# EAGLE design StasDuino_Rev3 (EAGLE 9.5.2)
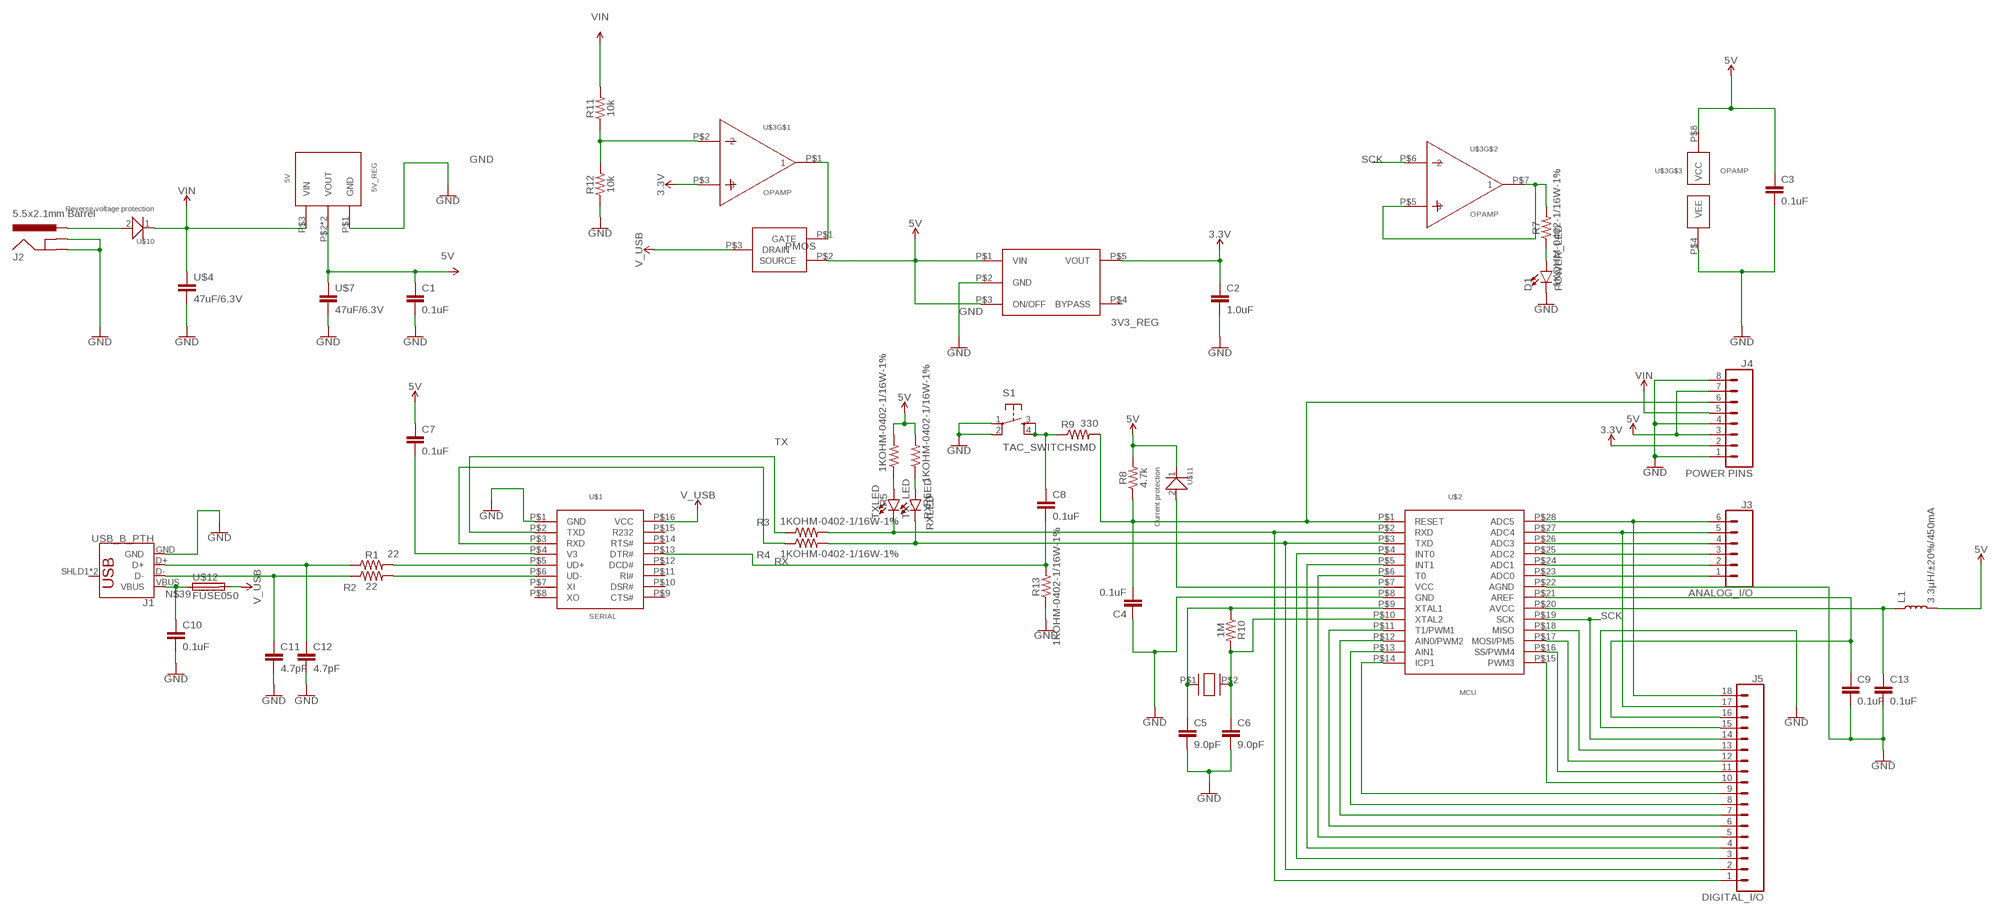
[diagram p0: schematic, sheet 1]

## Parts
3V3_REG  3V3  3V3_REGULATOR  [3V3-REGULATOR]
5V_REG  5V  5V_REGULATOR  [5V_REGULATOR]
C1  0.1uF  0.1UF-0402-16V-10%  [0402]
C2  1.0uF  1.0UF-0402-16V-10%  [0402]
C3  0.1uF  0.1UF-0402-16V-10%  [0402]
C4  0.1uF  0.1UF-0402-16V-10%  [0402]
C5  9.0pF  9.0PF-0603-50V-10%  [0603]
C6  9.0pF  9.0PF-0603-50V-10%  [0603]
C7  0.1uF  0.1UF-0402-16V-10%  [0402]
C8  0.1uF  0.1UF-0402-16V-10%  [0402]
C9  0.1uF  0.1UF-0402-16V-10%  [0402]
C10  0.1uF  0.1UF-0402-16V-10%  [0402]
C11  4.7pF  4.7PF-0603-50V-5%  [0603]
C12  4.7pF  4.7PF-0603-50V-5%  [0603]
C13  0.1uF  0.1UF-0402-16V-10%  [0402]
D1  POWER_LED  LED0603  [LED-0603]
J1  USB_B_PTH  [USB-B-PTH]
J2  5.5x2.1mm Barrel  POWER_JACKSMD  [POWER_JACK_SMD]
J3  ANALOG_I/O  CONN_06NO_SILK_FEMALE_PTH  [1X06_NO_SILK]
J4  POWER PINS  CONN_08NO_SILK_FEMALE_PTH  [1X08_NO_SILK]
J5  DIGITAL_I/O  CONN_18  [1X18_NO_SILK]
L1  3.3µH/±20%/450mA  INDUCTOR-0805-3.3UH  [0805]
PMOS  PMOS  [PMOSFET]
R1  22  22OHM-0402-1/10W-1%  [0402]
R2  22  22OHM-0402-1/10W-1%  [0402]
R3  1KOHM-0402-1/16W-1%  [0402]
R4  1KOHM-0402-1/16W-1%  [0402]
R5  1KOHM-0402-1/16W-1%  [0402]
R6  1KOHM-0402-1/16W-1%  [0402]
R7  1KOHM-0402-1/16W-1%  [0402]
R8  4.7k  4.7KOHM-0603-1/10W-1%  [0603]
R9  330  330OHM-0603-1/10W-1%  [0603]
R10  1M  1MOHM-0603-1/4W-5%  [0603]
R11  10k  10KOHM-0402-1/16W-1%  [0402]
R12  10k  10KOHM-0402-1/16W-1%  [0402]
R13  1KOHM-0402-1/16W-1%  [0402]
RXLED  RX_LED  LED0603  [LED-0603]
S1  TAC_SWITCHSMD  [TACTILE-SWITCH-SMD]
TXLED  TX_LED  LED0603  [LED-0603]
U$1  SERIAL  CH340C  [CH340G/C]
U$2  MCU  ATMEGA328P  [ATMEGA328P]
U$3  OPAMP  DUAL_OPAMP  [DUAL_OPAMP]
U$4  47uF/6.3V  47UF  [0805]
U$7  47uF/6.3V  47UF  [0805]
U$8  16MHz  CRYSTAL  [CRYSTAL]
U$10  Reverse voltage protection  DIODE_GEN_PURPDIODE  [0402]
U$11  Current protection  DIODE_GEN_PURPDIODE  [0402]
U$12  FUSE050  [MF-SMDF050]

## Nets
3.3V: 3V3_REG.P$5(VOUT) C2.1 J4.2 U$3.P$3
5V: 3V3_REG.P$1(VIN) 3V3_REG.P$3(ON/OFF) 5V_REG.P$2(VOUT) 5V_REG.P$2B(VOUT) C1.1 C3.1 C7.1 J4.3 J4.7 L1.2 PMOS.P$2(SOURCE) R5.2 R6.2 R8.2 U$3.P$8(VCC) U$7.1 U$11.1
D+: R1.2 U$1.P$5(UD+)
GND: 3V3_REG.P$2(GND) 5V_REG.P$1(GND) C1.2 C2.2 C3.2 C4.1 C5.2 C6.2 C9.2 C10.2 C11.2 C12.2 C13.2 D1.C J1.GND J2.GND(GNDBREAK) J2.P$4(GND) J4.1 J4.4 J4.8 J5.15 R12.1 R13.1 S1.1 S1.2 U$1.P$1(GND) U$2.P$8(GND) U$2.P$22(AGND) U$3.P$4(VEE) U$4.2 U$7.2
N$1: C12.1 J1.D+ R1.1
N$2: C4.2 J4.6 R8.1 R9.2 U$2.P$1(RESET)
N$3: C11.1 J1.D- R2.1
N$4: R2.2 U$1.P$6(UD-)
N$5: J5.2 R4.2 RXLED.C U$2.P$3(TXD)
N$6: J5.1 R3.2 TXLED.C U$2.P$2(RXD)
N$7: C8.1 R9.1 S1.3 S1.4
N$8: R5.1 TXLED.A
N$9: R6.1 RXLED.A
N$10: D1.A R7.1
N$11: R7.2 U$3.P$5 U$3.P$7
N$12: C5.1 R10.1 U$2.P$9(XTAL1) U$8.P$1
N$13: C6.1 R10.2 U$2.P$10(XTAL2) U$8.P$2
N$14: J3.6 J5.18 U$2.P$28(ADC5)
N$15: PMOS.P$1(GATE) U$3.P$1
N$16: J2.VIN0(PWR) U$10.2
N$17: R11.1 R12.2 U$3.P$2
N$18: C7.2 U$1.P$4(V3)
N$19: C8.2 R13.2 U$1.P$13(DTR#)
N$20: U$2.P$7(VCC) U$11.2
N$21: J3.5 J5.17 U$2.P$27(ADC4)
N$22: J3.4 U$2.P$26(ADC3)
N$23: J3.3 U$2.P$25(ADC2)
N$24: J3.2 U$2.P$24(ADC1)
N$25: J3.1 U$2.P$23(ADC0)
N$26: J5.3 U$2.P$4(INT0)
N$27: J5.4 U$2.P$5(INT1)
N$28: J5.5 U$2.P$6(T0)
N$29: J5.6 U$2.P$11(T1/PWM1)
N$30: J5.7 U$2.P$12(AIN0/PWM2)
N$31: J5.8 U$2.P$13(AIN1)
N$32: J5.9 U$2.P$14(ICP1)
N$33: J5.10 U$2.P$15(PWM3)
N$34: J5.11 U$2.P$16(SS/PWM4)
N$35: J5.12 U$2.P$17(MOSI/PM5)
N$36: J5.13 U$2.P$18(MISO)
N$38: C9.1 J5.16 U$2.P$21(AREF)
N$39: C10.1 J1.VBUS U$12.1
N$40: C13.1 L1.1 U$2.P$20(AVCC)
RX: R4.1 U$1.P$3(RXD)
SCK: J5.14 U$2.P$19(SCK) U$3.P$6
TX: R3.1 U$1.P$2(TXD)
V_USB: PMOS.P$3(DRAIN) U$1.P$16(VCC) U$12.2
VIN: 5V_REG.P$3(VIN) J4.5 R11.2 U$4.1 U$10.1
Unconnected: 3V3_REG.P$4(BYPASS) J1.SHLD1(SHIELD) J1.SHLD2(SHIELD) U$1.P$7(XI) U$1.P$8(XO) U$1.P$9(CTS#) U$1.P$10(DSR#) U$1.P$11(RI#) U$1.P$12(DCD#) U$1.P$14(RTS#) U$1.P$15(R232)

## Library data of the parts
3V3_REG = StasDuino_Lib:3V3_REGULATOR
5V_REG = StasDuino_Lib:5V_REGULATOR
C1 C3 C4 C7-C10 C13 = StasDuino_Lib:0.1UF: 0.1µF ceramic capacitors A capacitor is a passive two-terminal electrical component used to store electrical energy temporarily in an electric field.; PROD_ID: CAP-12416
C2 = StasDuino_Lib:1.0UF: 1µF ceramic capacitors A capacitor is a passive two-terminal electrical component used to store electrical energy temporarily in an electric field.; PROD_ID: CAP-12417
C5 C6 = SparkFun-Capacitors:9.0PF: 9.0pF ceramic capacitors A capacitor is a passive two-terminal electrical component used to store electrical energy temporarily in an electric field.; PROD_ID: CAP-09341
C11 C12 = SparkFun-Capacitors:4.7PF: 4.7pF ceramic capacitors A capacitor is a passive two-terminal electrical component used to store electrical energy temporarily in an electric field.; PROD_ID: CAP-07880
D1 RXLED TXLED = StasDuino_Lib:LED: LED (Generic) Standard schematic elements and footprints for 5mm, 3mm, 1206, and 0603 sized LEDs. Generic LEDs with no color specified.
J1 = StasDuino_Lib:USB_B: USB Type B Connector SparkFun Products: SparkFun Stepoko <https://www.sparkfun.com/products/13899> PTH; PROD_ID: CONN-08278; SF_ID: PRT-00139
J2 = StasDuino_Lib:POWER_JACK: Power Jack Connector This is the standard 5.5mm barrel jack for power. The PTH is the most common, proven, reliable, footprint. The Slot footprint only works if the mill layer is transmitted to the PCB fab house so be warned. Here are the connectors we sell at SparkFun: DC Barrel Power Jack/Connector <https://www.sparkfun.com/products/119> (PRT-00119) DC Barrel Power Jack/Connector (SMD) <https://www.sparkfun.com/products/12748> (PRT-12748) DC Barrel Jack Adapter - Breadboard Compatible <https://www.sparkfun.com/products/10811> (PRT-10811) It is used on this SparkFun product (and many, many others): SparkFun RedBoard - Programmed with Arduino <https://www.sparkfun.com/products/12757> (DEV-12757) Also, if you need a mating power supply or connector, please check these out: Wall Adapter Power Supply - 9VDC 650mA <https://www.sparkfun.com/products/298> (TOL-00298) DC Barrel Jack Adapter - Male <https://www.sparkfun.com/products/10287> (PRT-10287); PROD_ID: CONN-08106; SF_ID: PRT-12748
J3 = StasDuino_Lib:CONN_06: Multi connection point. Often used as Generic Header-pin footprint for 0.1 inch spaced/style header connections On any of the 0.1 inch spaced packages, you can populate with these: Break Away Headers - Straight <https://www.sparkfun.com/products/116> (PRT-00116) Break Away Male Headers - Right Angle <https://www.sparkfun.com/products/553> (PRT-00553) Female Headers <https://www.sparkfun.com/products/115> (PRT-00115) Break Away Headers - Machine Pin <https://www.sparkfun.com/products/117> (PRT-00117) Break Away Female Headers - Swiss Machine Pin <https://www.sparkfun.com/products/743> (PRT-00743) Arduino Stackable Header - 6 Pin <https://www.sparkfun.com/products/9280> (PRT-09280) For SCREWTERMINALS and SPRING TERMINALS visit here: Screw Terimnals on SparkFun.com <https://www.sparkfun.com/search/results?term=Screw+Terminals> (5mm/3.5mm/2.54mm spacing) This device is also useful as a general connection point to wire up your design to another part of your project. Our various solder wires solder well into these plated through hole pads. Hook-Up Wire - Assortment (Stranded, 22 AWG) <https://www.sparkfun.com/products/11375> (PRT-11375) Hook-Up Wire - Assortment (Solid Core, 22 AWG) <https://www.sparkfun.com/products/11367> (PRT-11367) View the entire wire category on our website here <https://www.sparkfun.com/categories/141>; PROD_ID: CONN-08437
J4 = StasDuino_Lib:CONN_08: Multi connection point. Often used as Generic Header-pin footprint for 0.1 inch spaced/style header connections On any of the 0.1 inch spaced packages, you can populate with these: Break Away Headers - Straight <https://www.sparkfun.com/products/116> (PRT-00116) Break Away Male Headers - Right Angle <https://www.sparkfun.com/products/553> (PRT-00553) Female Headers <https://www.sparkfun.com/products/115> (PRT-00115) Break Away Headers - Machine Pin <https://www.sparkfun.com/products/117> (PRT-00117) Break Away Female Headers - Swiss Machine Pin <https://www.sparkfun.com/products/743> (PRT-00743) Arduino Stackable Header - 8 Pin <https://www.sparkfun.com/products/9279> (PRT-09279) For SCREWTERMINALS and SPRING TERMINALS visit here: Screw Terimnals on SparkFun.com <https://www.sparkfun.com/search/results?term=Screw+Terminals> (5mm/3.5mm/2.54mm spacing) This device is also useful as a general connection point to wire up your design to another part of your project. Our various solder wires solder well into these plated through hole pads. Hook-Up Wire - Assortment (Stranded, 22 AWG) <https://www.sparkfun.com/products/11375> (PRT-11375) Hook-Up Wire - Assortment (Solid Core, 22 AWG) <https://www.sparkfun.com/products/11367> (PRT-11367) View the entire wire category on our website here <https://www.sparkfun.com/categories/141> Special notes: Molex polarized connector foot print use with SKU : PRT-08231 with associated crimp pins and housings. 1MM SMD Version SKU: PRT-10208 NOTES ON THE VARIANTS LOCK and LOCK_LONGPADS... This footprint was designed to help hold the alignment of a through-hole component (i.e. 6-pin header) while soldering it into place. You may notice that each hole has been shifted either up or down by 0.005 of an inch from it's more standard position (which is a perfectly straight line). This slight alteration caused the pins (the squares in the middle) to touch the edges of the holes. Because they are alternating, it causes a "brace" to hold the component in place. 0.005 has proven to be the perfect amount of "off-center" position when using our standard breakaway headers. Although looks a little odd when you look at the bare footprint, once you have a header in there, the alteration is very hard to notice. Also,if you push a header all the way into place, it is covered up entirely on the bottom side.; PROD_ID: CONN-08438
J5 = StasDuino_Lib:CONN_18: Multi connection point. Often used as Generic Header-pin footprint for 0.1 inch spaced/style header connections On any of the 0.1 inch spaced packages, you can populate with these: Break Away Headers - Straight <https://www.sparkfun.com/products/116> (PRT-00116) Break Away Male Headers - Right Angle <https://www.sparkfun.com/products/553> (PRT-00553) Female Headers <https://www.sparkfun.com/products/115> (PRT-00115) Break Away Headers - Machine Pin <https://www.sparkfun.com/products/117> (PRT-00117) Break Away Female Headers - Swiss Machine Pin <https://www.sparkfun.com/products/743> (PRT-00743) For SCREWTERMINALS and SPRING TERMINALS visit here: Screw Terimnals on SparkFun.com <https://www.sparkfun.com/search/results?term=Screw+Terminals> (5mm/3.5mm/2.54mm spacing) This device is also useful as a general connection point to wire up your design to another part of your project. Our various solder wires solder well into these plated through hole pads. Hook-Up Wire - Assortment (Stranded, 22 AWG) <https://www.sparkfun.com/products/11375> (PRT-11375) Hook-Up Wire - Assortment (Solid Core, 22 AWG) <https://www.sparkfun.com/products/11367> (PRT-11367) View the entire wire category on our website here <https://www.sparkfun.com/categories/141> Special notes: Molex polarized connector foot print use with SKU : PRT-08231 with associated crimp pins and housings. 1MM SMD Version SKU: PRT-10208 NOTES ON THE VARIANTS LOCK and LOCK_LONGPADS... This footprint was designed to help hold the alignment of a through-hole component (i.e. 6-pin header) while soldering it into place. You may notice that each hole has been shifted either up or down by 0.005 of an inch from it's more standard position (which is a perfectly straight line). This slight alteration caused the pins (the squares in the middle) to touch the edges of the holes. Because they are alternating, it causes a "brace" to hold the component in place. 0.005 has proven to be the perfect amount of "off-center" position when using our standard breakaway headers. Although looks a little odd when you look at the bare footprint, once you have a header in there, the alteration is very hard to notice. Also,if you push a header all the way into place, it is covered up entirely on the bottom side.
L1 = SparkFun-Coils:INDUCTOR: Inductors Resist changes in electrical current. Basically a coil of wire. SparkFun Products: SparkFun Load Cell Amplifier - HX711 <https://www.sparkfun.com/products/13879> IOIO-OTG - V2.2 <https://www.sparkfun.com/products/13613>; PROD_ID: NDUC-13076
PMOS = StasDuino_Lib:PMOS
R1 R2 = StasDuino_Lib:22OHM: 22Ω resistor A resistor is a passive two-terminal electrical component that implements electrical resistance as a circuit element. Resistors act to reduce current flow, and, at the same time, act to lower voltage levels within circuits. - Wikipedia; PROD_ID: RES-12427
R3-R7 R13 = StasDuino_Lib:1KOHM: 1kΩ resistor A resistor is a passive two-terminal electrical component that implements electrical resistance as a circuit element. Resistors act to reduce current flow, and, at the same time, act to lower voltage levels within circuits. - Wikipedia; PROD_ID: RES-14342
R8 = StasDuino_Lib:4.7KOHM: 4.7kΩ resistor A resistor is a passive two-terminal electrical component that implements electrical resistance as a circuit element. Resistors act to reduce current flow, and, at the same time, act to lower voltage levels within circuits. - Wikipedia; PROD_ID: RES-07857
R9 = StasDuino_Lib:330OHM: 330Ω resistor A resistor is a passive two-terminal electrical component that implements electrical resistance as a circuit element. Resistors act to reduce current flow, and, at the same time, act to lower voltage levels within circuits. - Wikipedia; PROD_ID: RES-00818
R10 = StasDuino_Lib:1MOHM: 1MΩ resistor A resistor is a passive two-terminal electrical component that implements electrical resistance as a circuit element. Resistors act to reduce current flow, and, at the same time, act to lower voltage levels within circuits. - Wikipedia; PROD_ID: RES-07868
R11 R12 = StasDuino_Lib:10KOHM: 10kΩ resistor A resistor is a passive two-terminal electrical component that implements electrical resistance as a circuit element. Resistors act to reduce current flow, and, at the same time, act to lower voltage levels within circuits. - Wikipedia; PROD_ID: RES-14241
S1 = StasDuino_Lib:TAC_SWITCH: Momentary Switch Button commonly used for reset or general input. Spark Fun Electronics SKU : COM-00097 SMT- SWCH-08247; PROD_ID: SWCH-08247
U$1 = StasDuino_Lib:CH340C
U$2 = StasDuino_Lib:ATMEGA328P
U$3 = StasDuino_Lib:DUAL_OPAMP
U$4 U$7 = StasDuino_Lib:47UF; PROD_ID: CAP-13854
U$8 = StasDuino_Lib:CRYSTAL
U$10 U$11 = StasDuino_Lib:DIODE_GEN_PURP
U$12 = StasDuino_Lib:FUSE: MF-SMDF Series - PRC Resettable Fuses Source: http://www.farnell.com/datasheets/716597.pdf

## Board
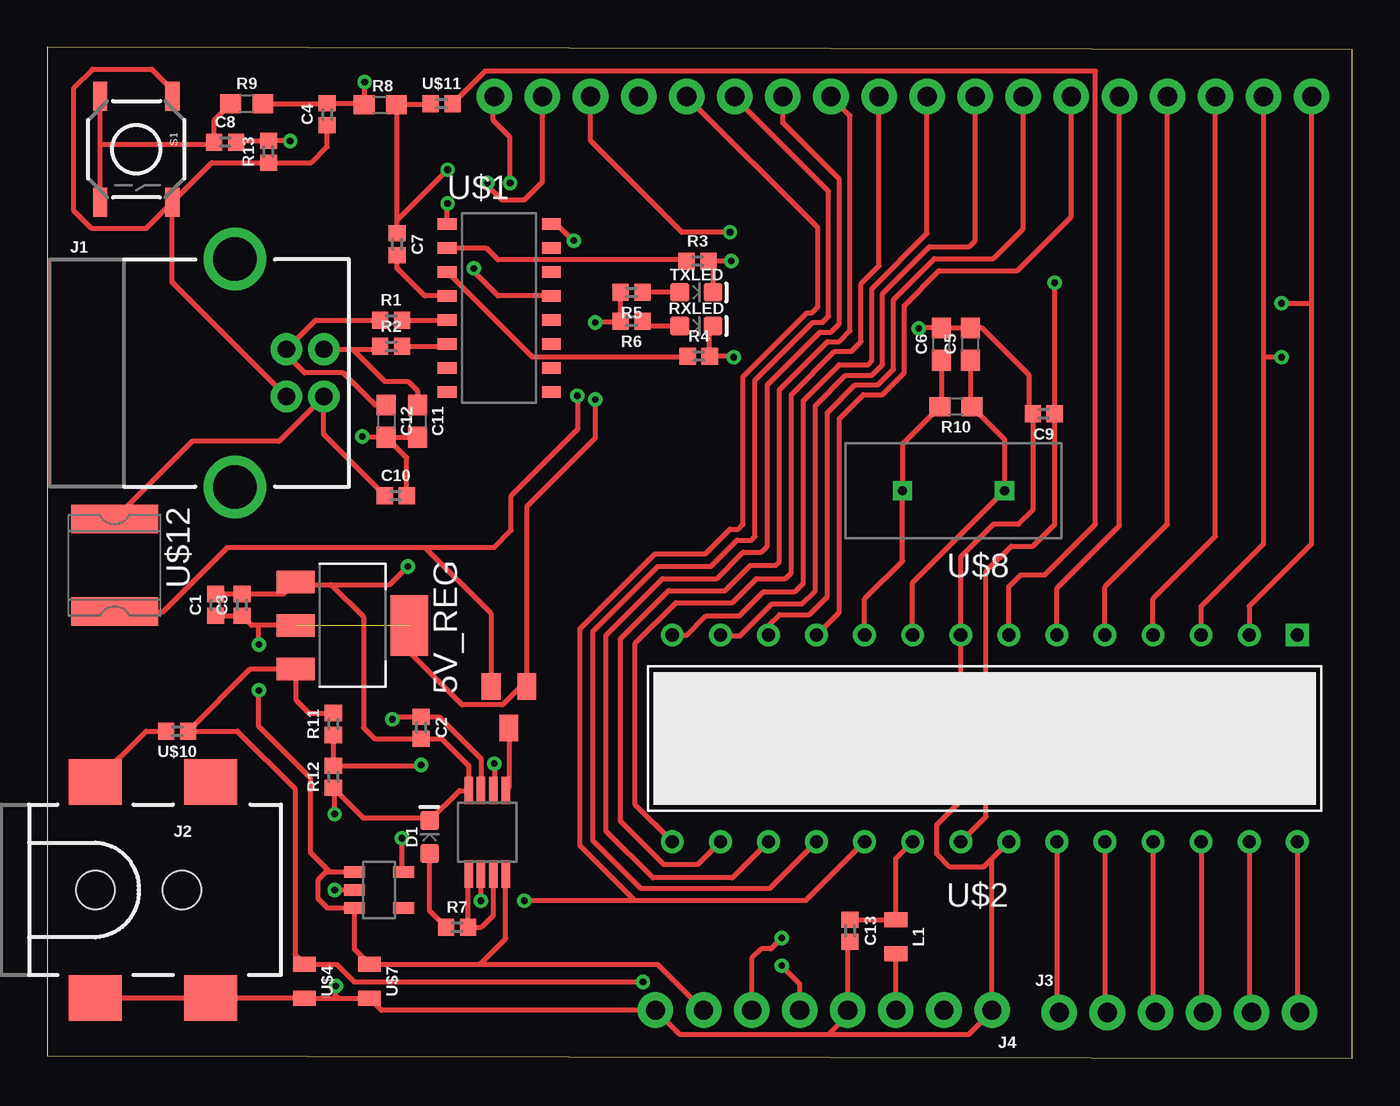
[diagram p1: board, top side]
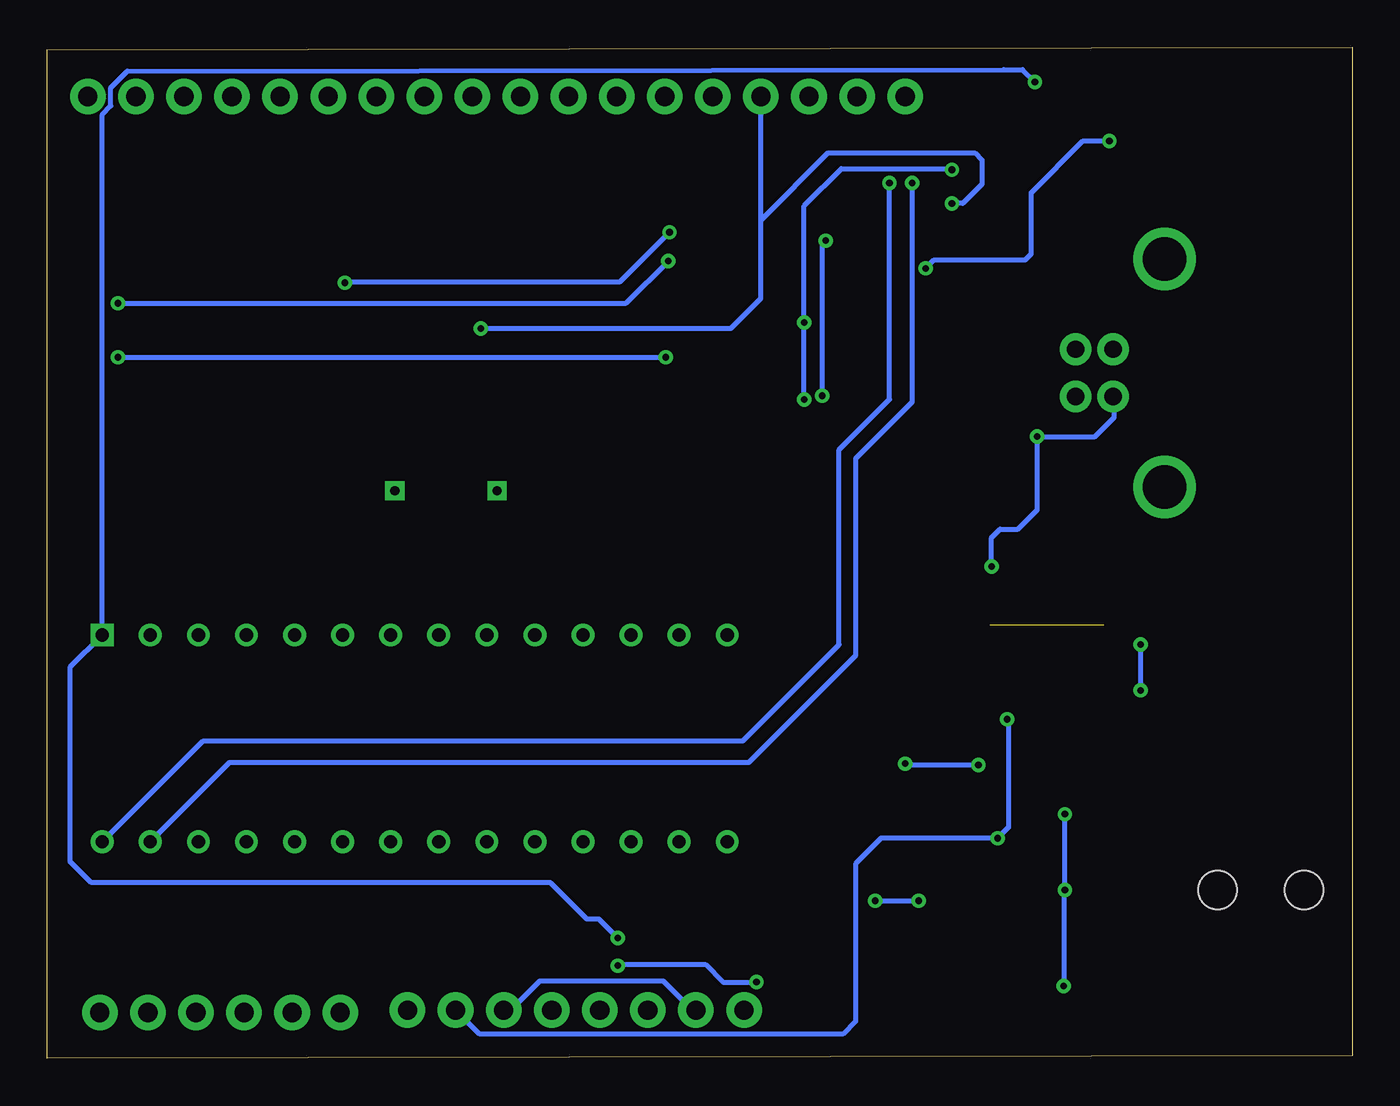
[diagram p2: board, bottom side, seen from below]

Size 68.94 x 53.39 mm. Coordinates in mm from the lower left corner, seen from the top.
Outline: 0,0.13 68.94,0 68.94,53.26 0,53.39 0,0.13
Copper layers (1*16): Top 0.035mm / dielectric 1.5mm / Bottom 0.035mm
Design rules "default": minimum track width 6mil, minimum drill 0.35mm, track to track 6mil, track to pad 6mil, pad to pad 6mil, via to via 6mil, smd to smd 6mil, copper to edge 40mil, drill to drill 6mil, minimum pad ring 10mil, minimum via ring 8mil, stop-mask expansion 4mil, vias tented up to drill 0mil, thermal gap 10mil

### Footprints (pad centres in the part's own frame; a part is rotated, then mirrored left to right if it is on the bottom)
3V3-REGULATOR = smd 1.1 x 0.6: P$1 -1.3,0.95; P$2 -1.3,0; P$3 -1.3,-0.95; P$4 1.3,-0.95; P$5 1.3,0.95
5V_REGULATOR = smd 1.2 x 2: P$1 -2.3,-3; P$2 0,-3; P$3 2.3,-3 | smd 3.2 x 2: P$2B 0,3
0402 = smd 0.85 x 0.9: 1 -0.58,0; 2 0.58,0
0603 = smd 1.1 x 1: 1 -0.85,0; 2 0.85,0
LED-0603 = smd 1 x 1: A -0.877,0; C 0.877,0
USB-B-PTH = drill 0.914 pad 1.676: D+ 4,1.25; D- 5.981,1.25; GND 4,-1.25; VBUS 5.981,-1.25 | drill 2.286: SHLD1 1.282,-6.02; SHLD2 1.282,6.02
POWER_JACK_SMD = smd 2.8 x 2.4: GND 0,-5.7; P$4 6.1,-5.7; VIN0 0,5.7; VIN1 6.1,5.7 | hole 2.032: 0,0; 4.572,0
1X06_NO_SILK = drill 1.016 pad 1.88: 1 0,0; 2 2.54,0; 3 5.08,0; 4 7.62,0; 5 10.16,0; 6 12.7,0
1X08_NO_SILK = drill 1.016 pad 1.88: 1 0,0; 2 2.54,0; 3 5.08,0; 4 7.62,0; 5 10.16,0; 6 12.7,0; 7 15.24,0; 8 17.78,0
1X18_NO_SILK = drill 1.016 pad 1.88: 1 0,0; 2 2.54,0; 3 5.08,0; 4 7.62,0; 5 10.16,0; 6 12.7,0; 7 15.24,0; 8 17.78,0; 9 20.32,0; 10 22.86,0; 11 25.4,0; 12 27.94,0; 13 30.48,0; 14 33.02,0; 15 35.56,0; 16 38.1,0; 17 40.64,0; 18 43.18,0
0805 = smd 0.8 x 1.2: 1 -0.9,0; 2 0.9,0
PMOSFET = smd 1 x 1.4: P$1 0,1.1; P$2 -0.95,-1.1; P$3 0.95,-1.1
TACTILE-SWITCH-SMD = smd 1.524 x 0.762: 1 -2.794,1.905; 2 2.794,1.905; 3 -2.794,-1.905; 4 2.794,-1.905
CH340G/C = smd 1 x 0.6: P$1 -2.75,4.445; P$2 -2.75,3.175; P$3 -2.75,1.905; P$4 -2.75,0.635; P$5 -2.75,-0.635; P$6 -2.75,-1.905; P$7 -2.75,-3.175; P$8 -2.75,-4.445; P$9 2.75,-4.445; P$10 2.75,-3.175; P$11 2.75,-1.905; P$12 2.75,-0.635; P$13 2.75,0.635; P$14 2.75,1.905; P$15 2.75,3.175; P$16 2.75,4.445
ATMEGA328P = drill 0.7 square: P$1 -16.51,-5.461 | drill 0.7: P$2 -13.97,-5.461; P$3 -11.43,-5.461; P$4 -8.89,-5.461; P$5 -6.35,-5.461; P$6 -3.81,-5.461; P$7 -1.27,-5.461; P$8 1.27,-5.461; P$9 3.81,-5.461; P$10 6.35,-5.461; P$11 8.89,-5.461; P$12 11.43,-5.461; P$13 13.97,-5.461; P$14 16.51,-5.461; P$15 16.51,5.461; P$16 13.97,5.461; P$17 11.43,5.461; P$18 8.89,5.461; P$19 6.35,5.461; P$20 3.81,5.461; P$21 1.27,5.461; P$22 -1.27,5.461; P$23 -3.81,5.461; P$24 -6.35,5.461; P$25 -8.89,5.461; P$26 -11.43,5.461; P$27 -13.97,5.461; P$28 -16.51,5.461
DUAL_OPAMP = smd 0.45 x 1.45: P$1 -0.975,-2.2; P$2 -0.325,-2.2; P$3 0.325,-2.2; P$4 0.975,-2.2; P$5 0.975,2.2; P$6 0.325,2.2; P$7 -0.325,2.2; P$8 -0.975,2.2
CRYSTAL = drill 0.5 square: P$1 -2.7,0; P$2 2.7,0
MF-SMDF050 = smd 1.5 x 4.6: 1 -2.45,0; 2 2.45,0

### Placement (x,y rotation side)
3V3_REG  17.53,8.89 0 top
5V_REG  16.13,22.86 270 top
C1  8.89,23.94 90 top
C2  19.75,17.46 270 top
C3  10.29,23.94 90 top
C4  14.8,49.85 90 top
C5  48.77,37.72 90 top
C6  47.24,37.72 90 top
C7  18.48,42.99 270 top
C8  9.4,48.39 0 top
C9  52.64,34.04 180 top
C10  18.41,29.72 0 top
C11  19.56,33.66 270 top
C12  17.91,33.66 270 top
C13  42.42,6.73 270 top
D1  20.19,11.68 90 top
J1  8.64,36.2 0 top
J2  2.54,8.89 0 top
J3  53.47,2.41 0 top
J4  49.91,2.54 180 top
J5  66.8,50.8 180 top
L1  44.83,6.41 270 top
PMOS  24.38,18.54 180 top
R1  18.16,38.99 0 top
R2  18.16,37.59 0 top
R3  34.35,42.1 0 top
R4  34.42,37.08 0 top
R5  30.86,40.45 180 top
R6  30.86,38.93 180 top
R7  21.65,6.92 0 top
R8  17.59,50.36 0 top
R9  10.54,50.42 0 top
R10  48.01,34.42 180 top
R11  15.11,17.65 90 top
R12  15.11,14.86 90 top
R13  11.68,47.88 90 top
RXLED  34.29,38.67 0 top
S1  4.7,48.01 270 top
TXLED  34.29,40.45 0 top
U$1  23.88,39.62 0 top
U$2  49.53,16.89 180 top
U$3  23.24,11.94 180 top
U$4  13.59,4.06 270 top
U$7  17.02,4.06 270 top
U$8  47.88,29.97 180 top
U$10  6.86,17.27 180 top
U$11  20.83,50.42 0 top
U$12  3.56,26.04 270 top

### Tracks (layer width: path | path; a pad name or v marks a point on that pad's centre or on a via)
3.3V  (via drill 0.35)
  Top 0.254: 3V3_REG.P$5 18.73,9.93 v18.73,11.62 | U$3.P$3 22.92,15.82 20.7,18.03 19.76,18.03 C2.1 18.36,18.04 v18.22,17.91
  Bottom 0.254: v18.22,17.91 18.16,17.84 18.16,12.19 v18.73,11.62 24.89,11.62 26.24,10.27 26.24,1.94 26.91,1.27 46.1,1.27 J4.2
5V  (via drill 0.35)  (1 unrouted)
  Top 0.254: 14.92,9.84 14.73,9.84 14.29,9.4 14.29,8.45 14.79,7.94 3V3_REG.P$3 16.23,5.76 U$7.1 22.86,4.96 | 14.92,9.84 3V3_REG.P$1 | 5V_REG.P$2 11.18,22.86 | 11.18,22.86 10.79,22.86 C3.1 C1.1 | 5V_REG.P$2B 19.13,21.45 21.91,18.66 24.05,18.66 25.03,19.64 PMOS.P$2 25.33,21.52 25.34,21.53 25.34,29.15 28.96,32.77 v28.96,34.8 | v28.96,38.86 30.22,38.86 R6.2 R5.2 | v21.14,46.93 18.48,44.26 C7.1 18.48,50.32 R8.2 20.18,50.36 U$11.1 | 22.86,4.96 32.25,4.96 J4.7 | J4.3 L1.2 | 22.86,4.96 24.22,6.32 U$3.P$8 | 14.92,9.84 13.91,10.86 13.91,14.79 11.18,17.53 v11.18,19.43 | v11.18,21.84 11.18,22.86
  Bottom 0.254: v21.14,46.93 21.21,46.99 26.99,46.99 28.96,45.02 v28.96,38.86 v28.96,34.8 | J4.7 34.85,2.54 36.39,4.08 42.92,4.08 44.46,2.54 J4.3 | v11.18,19.43 v11.18,21.84
D+
  Top 0.254: R1.2 U$1.P$5
GND  (via drill 0.35)
  Top 0.254: J2.GND J2.P$4 13.56,3.19 U$4.2 15.37,3.16 | 15.37,3.16 U$7.2 17.65,2.53 J4.8 33.4,1.27 41.27,1.26 | 41.27,1.26 42.29,2.27 J4.4 42.29,6.02 C13.2 | 41.27,1.26 48.69,1.26 49.91,2.48 J4.1 49.91,10.54 | 42.49,6.15 C13.2 | 15.37,3.16 15.24,3.29 v15.24,3.81 | v15.18,12.89 15.18,14.21 R12.1 16.7,12.69 20.07,12.69 D1.C 21.77,14.14 U$3.P$4 22.27,15.45 20.84,16.88 C2.2 17.28,16.88 16.7,17.46 16.7,23.3 14.99,25.02 | v15.18,8.89 3V3_REG.P$2 | C1.2 C3.2 12.49,24.52 5V_REG.P$1 13.27,25.02 14.99,25.02 | C12.2 C11.2 | J1.GND 6.6,40.98 S1.2 | S1.2 5.21,43.82 2.35,43.82 1.4,44.77 1.4,51.24 2.39,52.24 5.52,52.24 6.6,51.16 S1.1 | S1.2 8.69,47.3 R13.1 13.96,47.3 14.8,48.13 C4.1 | 21.06,44.01 U$1.P$1 21.13,45.13 v21.14,45.15 | C10.2 19,31.72 C12.2 | 42.39,6.12 C13.2 | U$2.P$22 49.91,10.54 | C12.2 16.66,32.8 v16.64,32.83 | v46.04,38.54 46.06,38.57 C6.2 C5.2 49.37,38.57 51.88,36.06 51.88,34.22 C9.2 52.06,28.95 51.31,28.19 49.97,28.19 48.26,26.48 U$2.P$8 48.26,13.59 46.99,12.32 46.99,10.79 47.69,10.1 49.47,10.1 49.91,10.54 | 14.99,25.02 18.1,25.02 v19.05,25.97
  Bottom 0.254: v15.24,3.81 15.24,8.83 v15.18,8.89 v15.18,12.89 | J1.GND 12.57,34.88 12.57,33.85 13.59,32.83 v16.64,32.83 16.64,28.96 17.65,27.94 18.61,27.94 19.05,27.5 v19.05,25.97 | v46.04,38.54 32.83,38.54 31.24,40.13 31.24,44.26 | 31.24,44.26 J5.15 | v21.14,45.15 20.57,45.15 19.56,46.16 19.56,47.43 19.94,47.82 27.69,47.82 31.24,44.26
N$1
  Top 0.254: C12.1 17.31,34.51 15.62,36.2 13.59,36.2 12.64,37.15 J1.D+ 14.18,38.99 R1.1
N$2  (via drill 0.35)
  Top 0.254: 11.45,50.36 R9.2 14.79,50.42 C4.2 16.67,50.43 R8.1 16.74,51.54 v16.76,51.56 | J4.6 37.21,5.27 37.72,5.78 38.23,5.78 v38.8,6.35
  Bottom 0.254: v16.76,51.56 17.42,52.21 18.41,52.21 64.71,52.13 65.58,51.26 65.58,50.3 66.04,49.84 U$2.P$1 67.75,20.64 67.75,10.41 66.61,9.27 42.35,9.27 40.45,7.37 39.81,7.37 v38.8,6.35
N$3
  Top 0.254: J1.D- 16.13,37.45 | 16.13,37.45 17.43,37.45 R2.1 | 16.13,37.45 17.82,35.75 19.05,35.75 19.56,35.24 C11.1
N$4
  Top 0.254: R2.2 21,37.59 U$1.P$6
N$5  (via drill 0.35)
  Top 0.254: RXLED.C 35,38.5 R4.2 36.2,37.08 v36.26,37.02 | U$2.P$3 60.96,23.88 64.26,27.18 64.26,37.02 | 64.26,37.02 J5.2 | v65.22,37.02 64.26,37.02
  Bottom 0.254: v65.22,37.02 v36.26,37.02
N$6  (via drill 0.35)
  Top 0.254: TXLED.C 35.17,41.87 R3.2 v36.13,42.1 | U$2.P$2 63.5,23.88 66.8,27.18 66.8,39.88 | v65.22,39.88 66.8,39.88 | 66.8,39.88 J5.1
  Bottom 0.254: v36.13,42.1 38.35,39.88 v65.22,39.88
N$7
  Top 0.254: S1.4 2.79,48.26 | 2.79,48.26 S1.3 | 2.79,48.26 8.69,48.26 C8.1 8.82,49.55 R9.1
N$8
  Top 0.254: TXLED.A R5.1
N$9
  Top 0.254: RXLED.A 31.7,38.67 R6.1
N$10
  Top 0.254: R7.1 20.19,7.8 D1.A
N$11
  Top 0.254: U$3.P$5 22.23,9.71 R7.2 22.93,6.92 23.57,7.55 U$3.P$7
N$12
  Top 0.254: C5.1 48.77,34.51 R10.1 50.58,32.69 U$8.P$1 45.72,25.11 U$2.P$9
N$13
  Top 0.254: C6.1 47.24,34.51 R10.2 45.18,32.44 U$8.P$2 45.18,26.26 43.18,24.26 U$2.P$10
N$14  (via drill 0.35)
  Top 0.254: U$2.P$28 66.04,2.54 J3.6 | v24.45,46.23 24.45,48.64 23.56,49.53 23.56,50.74 J5.18
  Bottom 0.254: U$2.P$28 60.71,16.76 32.19,16.76 27.11,21.84 27.11,32.13 24.45,34.8 v24.45,46.23
N$15
  Top 0.254: PMOS.P$1 24.38,14.31 U$3.P$1
N$16
  Top 0.254: J2.VIN0 5.22,17.27 U$10.2
N$17  (via drill 0.35)
  Top 0.254: R11.1 R12.2 19.69,15.44 v19.75,15.49 | v23.62,15.56 23.62,14.19 U$3.P$2
  Bottom 0.254: v23.62,15.56 23.56,15.49 v19.75,15.49
N$18
  Top 0.254: U$1.P$4 19.94,40.26 18.48,41.72 C7.2
N$19  (via drill 0.35)
  Top 0.254: C8.2 10.05,48.46 R13.2 11.69,48.45 v12.83,48.45 | U$1.P$13 23.81,40.26 22.54,41.53 v22.54,41.72
  Bottom 0.254: v22.54,41.72 22.1,42.16 17.27,42.16 16.95,42.48 16.95,45.72 14.22,48.45 v12.83,48.45
N$20
  Top 0.254: U$2.P$7 50.8,24.89 51.44,25.53 52.7,25.53 55.38,28.21 55.38,52.13 23.12,52.13 U$11.2
N$21  (via drill 0.35)
  Top 0.254: U$2.P$27 63.5,2.54 J3.5 | v23.24,46.23 23.24,46.1 24,45.34 25.21,45.34 26.16,46.29 J5.17
  Bottom 0.254: U$2.P$27 59.31,15.62 31.88,15.62 26.23,21.27 26.23,31.69 23.24,34.67 v23.24,46.23
N$22
  Top 0.254: U$2.P$26 60.96,2.54 J3.4
N$23
  Top 0.254: U$2.P$25 58.42,2.54 J3.3
N$24
  Top 0.254: U$2.P$24 55.88,2.54 J3.2
N$25
  Top 0.254: U$2.P$23 53.34,2.54 J3.1
N$26
  Top 0.254: U$2.P$4 58.42,24.26 61.72,27.56 J5.3
N$27
  Top 0.254: U$2.P$5 55.88,24.89 59.18,28.19 J5.4
N$28
  Top 0.254: U$2.P$6 53.34,24.82 56.64,28.13 J5.5
N$29
  Top 0.254: U$2.P$11 41.85,23.56 41.85,33.78 43.12,35.05 44.13,35.05 45.28,36.2 45.28,39.75 47.12,41.59 51.24,41.59 54.1,44.45 J5.6
N$30
  Top 0.254: J5.7 51.56,43.82 49.97,42.23 46.86,42.23 44.7,40.07 44.7,36.39 43.88,35.56 42.67,35.56 41.21,34.1 41.21,24.38 40.26,23.43 38.67,23.43 38.1,22.86 U$2.P$12
N$31
  Top 0.254: J5.8 49.02,43.18 48.7,42.86 46.61,42.86 44.13,40.39 44.13,36.64 43.56,36.07 42.17,36.07 40.58,34.47 40.58,24.7 39.88,24 38.29,24 36.58,22.29 35.62,22.29 U$2.P$13
N$32
  Top 0.254: U$2.P$14 33.8,22.35 34.81,23.36 36.57,23.36 37.85,24.64 39.5,24.64 39.94,25.08 39.94,34.73 41.85,36.64 43.37,36.64 43.56,36.83 43.56,40.64 46.48,43.56 J5.9
N$33
  Top 0.254: U$2.P$15 31.05,13.4 31.05,21.91 33.21,24.07 36.2,24.07 37.47,25.34 38.99,25.34 39.31,25.65 39.31,35.05 41.59,37.34 42.48,37.34 42.99,37.85 42.99,40.89 43.94,41.85 J5.10
N$34
  Top 0.254: U$2.P$16 34.35,10.22 32.58,10.22 30.29,12.51 30.29,22.16 32.83,24.7 35.81,24.7 37.15,26.04 38.48,26.04 38.67,26.23 38.67,35.31 41.21,37.85 41.85,37.85 42.42,38.42 42.42,49.78 J5.11
N$35
  Top 0.254: U$2.P$17 36.2,9.53 32,9.53 29.53,12 29.53,22.35 32.51,25.34 35.37,25.34 36.77,26.73 37.72,26.73 38.04,27.05 38.04,35.56 40.83,38.35 41.4,38.35 41.85,38.8 41.85,46.42 38.86,49.4 J5.12
N$36
  Top 0.254: U$2.P$18 38.16,8.95 31.37,8.95 28.83,11.49 28.83,22.54 32.26,25.97 35.05,25.97 36.45,27.37 37.21,27.37 37.4,27.56 37.4,35.81 40.45,38.86 40.96,38.86 41.27,39.18 41.27,45.78 36.32,50.74 J5.13
N$38  (via drill 0.35)
  Top 0.254: U$2.P$21 49.59,12.76 49.59,25.72 50.93,27.05 52.07,27.05 53.22,28.2 C9.1 v53.22,40.95 v53.21,40.96 | v36.07,43.62 33.53,43.62 28.7,48.45 J5.16
  Bottom 0.254: v53.21,40.96 53.15,41.02 38.67,41.02 v36.07,43.62
N$39
  Top 0.254: J1.VBUS 14.6,34.93 | 14.6,34.93 12.25,32.58 7.65,32.58 U$12.1 | C10.1 14.6,32.95 14.6,34.93
N$40
  Top 0.254: C13.1 L1.1 44.83,10.54 U$2.P$20
RX
  Top 0.254: R4.1 33.78,37.03 25.63,37.03 U$1.P$3
SCK  (via drill 0.35)
  Top 0.254: U$2.P$19 40.07,8.32 31.05,8.32 | 31.05,8.32 v25.21,8.32 | v22.91,8.32 22.91,9.73 U$3.P$6 | J5.14 40.7,43.87 40.7,39.69 40.39,39.37 40.13,39.37 36.77,36 36.77,28.19 36.51,27.94 36.07,27.94 34.77,26.64 32.1,26.64 28.13,22.67 28.13,11.24 31.05,8.32
  Bottom 0.254: v25.21,8.32 v22.91,8.32
TX
  Top 0.254: U$1.P$2 23.18,42.8 23.8,42.17 33.7,42.17 R3.1
V_USB  (via drill 0.35)
  Top 0.254: U$12.2 6.12,23.58 9.53,26.99 19.94,26.99 | PMOS.P$3 23.43,23.49 19.94,26.99 | v27.81,43.18 27.77,43.18 26.88,44.07 U$1.P$16 | v28,34.99 28,33.21 24.51,29.72 24.51,27.88 23.62,26.99 19.94,26.99
  Bottom 0.254: v27.81,43.18 28,42.99 v28,34.99
VIN  (via drill 0.35)
  Top 0.254: R11.2 15.1,18.22 13.84,18.22 13.13,18.94 5V_REG.P$3 10.73,20.56 U$10.1 10.03,17.27 13.08,14.22 13.08,5.47 U$4.1 15.29,4.96 16.23,4.02 v31.47,4.02 | v38.8,4.89 39.75,3.94 J4.5
  Bottom 0.254: v31.47,4.02 33.25,4.02 34.18,4.95 38.67,4.95 38.73,4.89 v38.8,4.89